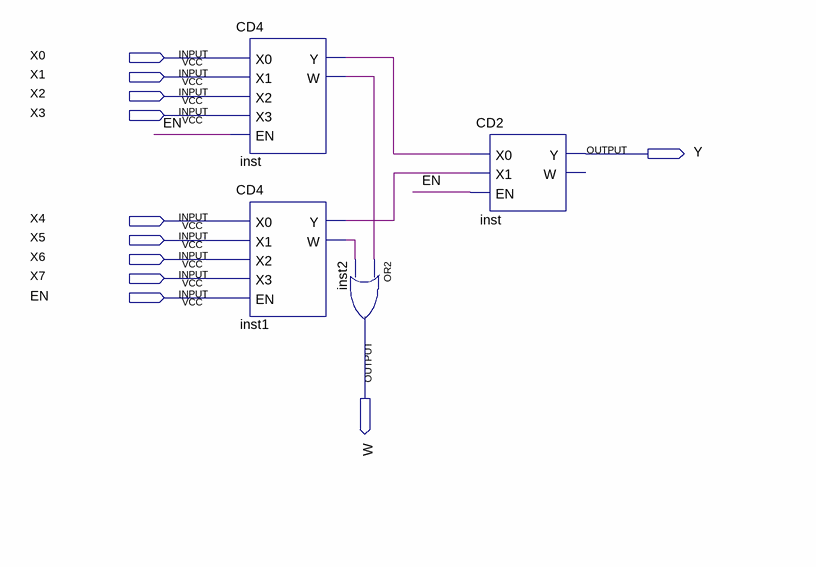
[diagram p0: schematic sheet]
// Quartus schematic CD8.bdf as structural Verilog: 4 symbols, 11 pins
module CD8 (
  input  X0,
  input  X1,
  input  X2,
  input  X3,
  input  X4,
  input  X5,
  input  X6,
  input  X7,
  input  EN,
  output Y,
  output W
);

  wire inst1_w, inst1_y, inst_w, inst_y;

  CD4 inst (.X0(X0), .X1(X1), .X2(X2), .X3(X3), .EN(EN), .Y(inst_y), .W(inst_w));
  CD4 inst1 (.X0(X4), .X1(X5), .X2(X6), .X3(X7), .EN(EN), .Y(inst1_y), .W(inst1_w));
  or inst2 (W, inst_w, inst1_w);
  CD2 inst_dup2 (.X0(inst_y), .X1(inst1_y), .EN(EN), .Y(Y));  // open: W
endmodule
